# Altium schematic sheet CutMonitor_PressureSensor.SchDoc
size 594 x 420 mm; DocumentNumber: ФНКЦ.452312.001 Э3; SheetNumber: 2; Format: A2
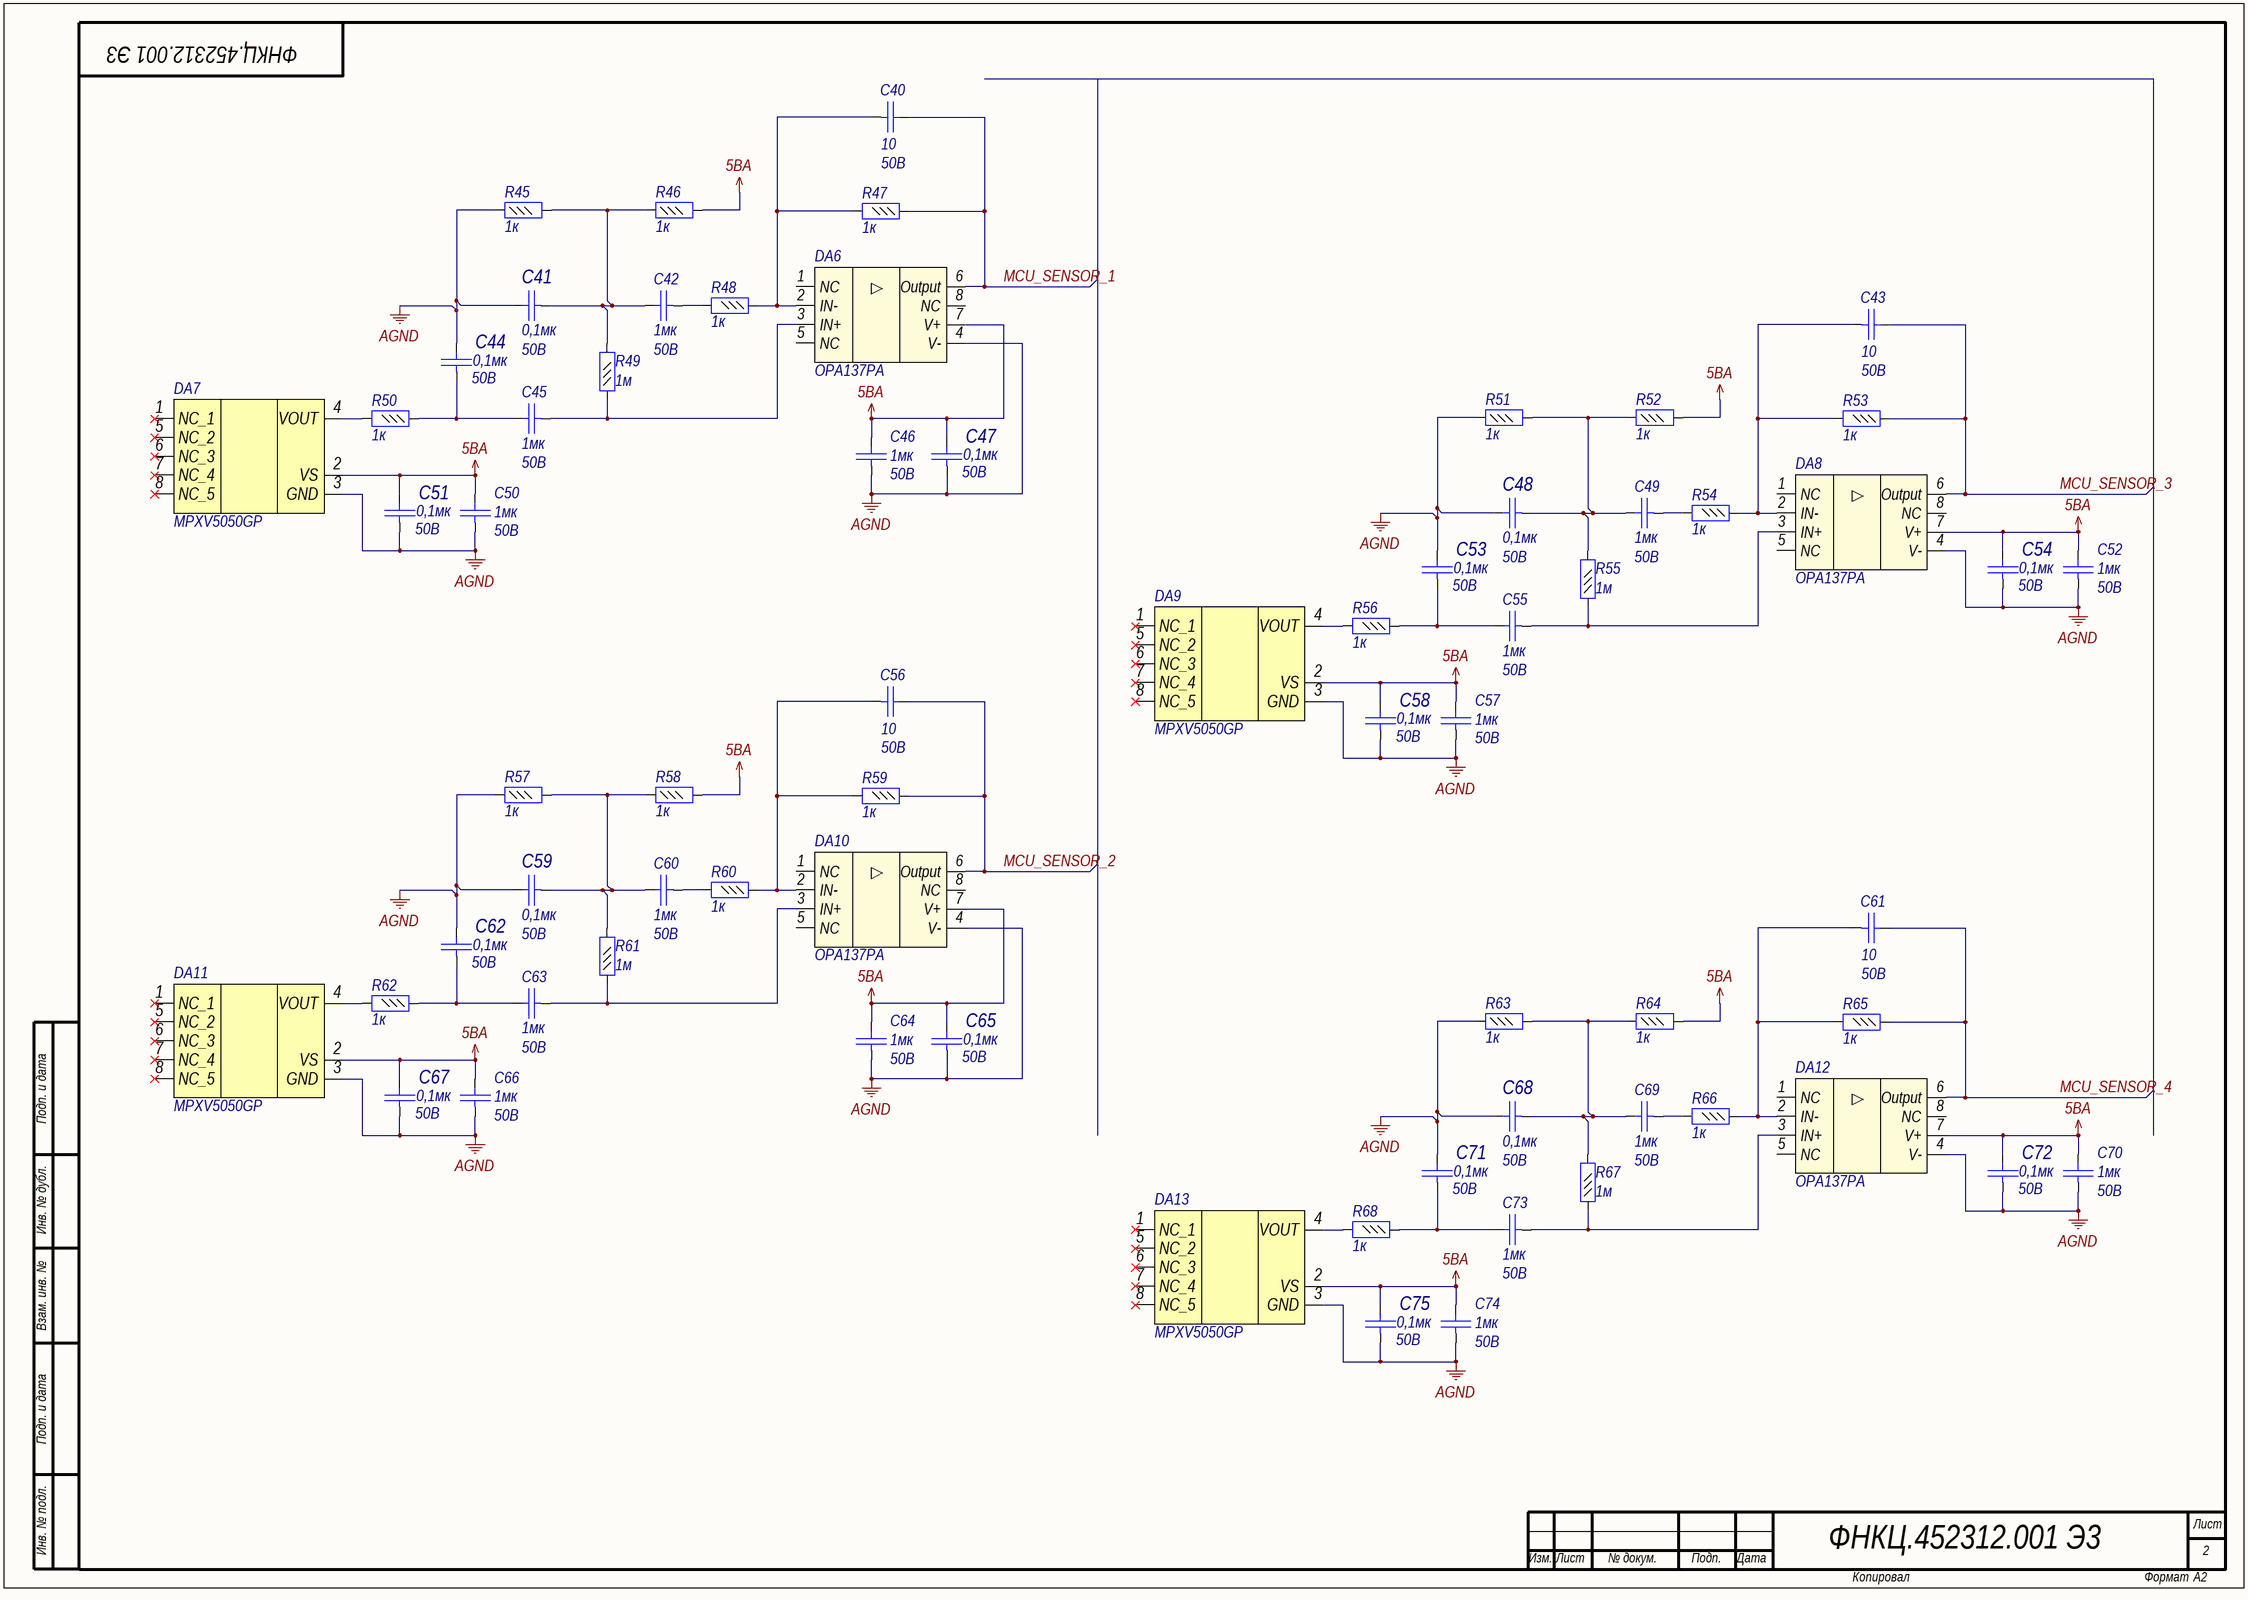
[diagram p0: CutMonitor_PressureSensor.SchDoc]

## Parts
C40  value 10  Voltage: 50B  [C0603]  (hidden comment: Capacitor)
C41  value 0,1мк  Voltage: 50B  [C0603]  (hidden comment: Capacitor)
C42  value 1мк  Voltage: 50B  [C0805]  (hidden comment: Capacitor)
C43  value 10  Voltage: 50B  [C0603]  (hidden comment: Capacitor)
C44  value 0,1мк  Voltage: 50B  [C0603]  (hidden comment: Capacitor)
C45  value 1мк  Voltage: 50B  [C0805]  (hidden comment: Capacitor)
C46  value 1мк  Voltage: 50B  [C0805]  (hidden comment: Capacitor)
C47  value 0,1мк  Voltage: 50B  [C0603]  (hidden comment: Capacitor)
C48  value 0,1мк  Voltage: 50B  [C0603]  (hidden comment: Capacitor)
C49  value 1мк  Voltage: 50B  [C0805]  (hidden comment: Capacitor)
C50  value 1мк  Voltage: 50B  [C0805]  (hidden comment: Capacitor)
C51  value 0,1мк  Voltage: 50B  [C0603]  (hidden comment: Capacitor)
C52  value 1мк  Voltage: 50B  [C0805]  (hidden comment: Capacitor)
C53  value 0,1мк  Voltage: 50B  [C0603]  (hidden comment: Capacitor)
C54  value 0,1мк  Voltage: 50B  [C0603]  (hidden comment: Capacitor)
C55  value 1мк  Voltage: 50B  [C0805]  (hidden comment: Capacitor)
C56  value 10  Voltage: 50B  [C0603]  (hidden comment: Capacitor)
C57  value 1мк  Voltage: 50B  [C0805]  (hidden comment: Capacitor)
C58  value 0,1мк  Voltage: 50B  [C0603]  (hidden comment: Capacitor)
C59  value 0,1мк  Voltage: 50B  [C0603]  (hidden comment: Capacitor)
C60  value 1мк  Voltage: 50B  [C0805]  (hidden comment: Capacitor)
C61  value 10  Voltage: 50B  [C0603]  (hidden comment: Capacitor)
C62  value 0,1мк  Voltage: 50B  [C0603]  (hidden comment: Capacitor)
C63  value 1мк  Voltage: 50B  [C0805]  (hidden comment: Capacitor)
C64  value 1мк  Voltage: 50B  [C0805]  (hidden comment: Capacitor)
C65  value 0,1мк  Voltage: 50B  [C0603]  (hidden comment: Capacitor)
C66  value 1мк  Voltage: 50B  [C0805]  (hidden comment: Capacitor)
C67  value 0,1мк  Voltage: 50B  [C0603]  (hidden comment: Capacitor)
C68  value 0,1мк  Voltage: 50B  [C0603]  (hidden comment: Capacitor)
C69  value 1мк  Voltage: 50B  [C0805]  (hidden comment: Capacitor)
C70  value 1мк  Voltage: 50B  [C0805]  (hidden comment: Capacitor)
C71  value 0,1мк  Voltage: 50B  [C0603]  (hidden comment: Capacitor)
C72  value 0,1мк  Voltage: 50B  [C0603]  (hidden comment: Capacitor)
C73  value 1мк  Voltage: 50B  [C0805]  (hidden comment: Capacitor)
C74  value 1мк  Voltage: 50B  [C0805]  (hidden comment: Capacitor)
C75  value 0,1мк  Voltage: 50B  [C0603]  (hidden comment: Capacitor)
DA6  OPA137PA  [DIP8]
DA7  MPXV5050GP  [SOP8]
DA8  OPA137PA  [DIP8]
DA9  MPXV5050GP  [SOP8]
DA10  OPA137PA  [DIP8]
DA11  MPXV5050GP  [SOP8]
DA12  OPA137PA  [DIP8]
DA13  MPXV5050GP  [SOP8]
R45  value 1к  [R0603]  (hidden comment: Resistor_0,062Вт)
R46  value 1к  [R0603]  (hidden comment: Resistor_0,062Вт)
R47  value 1к  [R0603]  (hidden comment: Resistor_0,062Вт)
R48  value 1к  [R0603]  (hidden comment: Resistor_0,062Вт)
R49  value 1м  [R0603]  (hidden comment: Resistor_0,062Вт)
R50  value 1к  [R0603]  (hidden comment: Resistor_0,062Вт)
R51  value 1к  [R0603]  (hidden comment: Resistor_0,062Вт)
R52  value 1к  [R0603]  (hidden comment: Resistor_0,062Вт)
R53  value 1к  [R0603]  (hidden comment: Resistor_0,062Вт)
R54  value 1к  [R0603]  (hidden comment: Resistor_0,062Вт)
R55  value 1м  [R0603]  (hidden comment: Resistor_0,062Вт)
R56  value 1к  [R0603]  (hidden comment: Resistor_0,062Вт)
R57  value 1к  [R0603]  (hidden comment: Resistor_0,062Вт)
R58  value 1к  [R0603]  (hidden comment: Resistor_0,062Вт)
R59  value 1к  [R0603]  (hidden comment: Resistor_0,062Вт)
R60  value 1к  [R0603]  (hidden comment: Resistor_0,062Вт)
R61  value 1м  [R0603]  (hidden comment: Resistor_0,062Вт)
R62  value 1к  [R0603]  (hidden comment: Resistor_0,062Вт)
R63  value 1к  [R0603]  (hidden comment: Resistor_0,062Вт)
R64  value 1к  [R0603]  (hidden comment: Resistor_0,062Вт)
R65  value 1к  [R0603]  (hidden comment: Resistor_0,062Вт)
R66  value 1к  [R0603]  (hidden comment: Resistor_0,062Вт)
R67  value 1м  [R0603]  (hidden comment: Resistor_0,062Вт)
R68  value 1к  [R0603]  (hidden comment: Resistor_0,062Вт)

## Nets
5BA: C46.2 C47.2 C50.2 C51.2 C52.2 C54.2 C57.2 C58.2 C64.2 C65.2 C66.2 C67.2 C70.2 C72.2 C74.2 C75.2 DA6.7(V+) DA7.2(VS) DA8.7(V+) DA9.2(VS) DA10.7(V+) DA11.2(VS) DA12.7(V+) DA13.2(VS) R46.2 R52.2 R58.2 R64.2
AGND: C41.2 C44.2 C46.1 C47.1 C48.2 C50.1 C51.1 C52.1 C53.2 C54.1 C57.1 C58.1 C59.2 C62.2 C64.1 C65.1 C66.1 C67.1 C68.2 C70.1 C71.2 C72.1 C74.1 C75.1 DA6.4(V-) DA7.3(GND) DA8.4(V-) DA9.3(GND) DA10.4(V-) DA11.3(GND) DA12.4(V-) DA13.3(GND) R45.1 R51.1 R57.1 R63.1
MCU_SENSOR_1: C40.2 DA6.6(Output) R47.1
MCU_SENSOR_2: C56.2 DA10.6(Output) R59.1
MCU_SENSOR_3: C43.2 DA8.6(Output) R53.1
MCU_SENSOR_4: C61.2 DA12.6(Output) R65.1
NetC40_1: C40.1 DA6.2(IN-) R47.2 R48.1
NetC41_1: C41.1 C42.2 R45.2 R46.1 R49.2
NetC42_1: C42.1 R48.2
NetC43_1: C43.1 DA8.2(IN-) R53.2 R54.1
NetC44_1: C44.1 C45.2 R50.1
NetC45_1: C45.1 DA6.3(IN+) R49.1
NetC48_1: C48.1 C49.2 R51.2 R52.1 R55.2
NetC49_1: C49.1 R54.2
NetC53_1: C53.1 C55.2 R56.1
NetC55_1: C55.1 DA8.3(IN+) R55.1
NetC56_1: C56.1 DA10.2(IN-) R59.2 R60.1
NetC59_1: C59.1 C60.2 R57.2 R58.1 R61.2
NetC60_1: C60.1 R60.2
NetC61_1: C61.1 DA12.2(IN-) R65.2 R66.1
NetC62_1: C62.1 C63.2 R62.1
NetC63_1: C63.1 DA10.3(IN+) R61.1
NetC68_1: C68.1 C69.2 R63.2 R64.1 R67.2
NetC69_1: C69.1 R66.2
NetC71_1: C71.1 C73.2 R68.1
NetC73_1: C73.1 DA12.3(IN+) R67.1
NetDA7_4: DA7.4(VOUT) R50.2
NetDA9_4: DA9.4(VOUT) R56.2
NetDA11_4: DA11.4(VOUT) R62.2
NetDA13_4: DA13.4(VOUT) R68.2

Not connected (* = marked no-connect by the designer): DA6 1(NC) 5(NC) 8(NC); DA7 1(NC_1)* 5(NC_2)* 6(NC_3)* 7(NC_4)* 8(NC_5)*; DA8 1(NC) 5(NC) 8(NC); DA9 1(NC_1)* 5(NC_2)* 6(NC_3)* 7(NC_4)* 8(NC_5)*; DA10 1(NC) 5(NC) 8(NC); DA11 1(NC_1)* 5(NC_2)* 6(NC_3)* 7(NC_4)* 8(NC_5)*; DA12 1(NC) 5(NC) 8(NC); DA13 1(NC_1)* 5(NC_2)* 6(NC_3)* 7(NC_4)* 8(NC_5)*

## Notes on the sheet
- Подп. и дата
- Инв. № дубл.
- Взам. инв. №
- Инв. № подл.
- Лист
- Изм.
- № докум.
- Подп.
- Дата
- Копировал
- Формат

## Library data of the parts
C40 C43 C56 C61 = cap71: Конденсатор; Part Name: Ceramic; Manufacture: Murata; Part Number: GRM1885C1H100J; id: cap71; TKE: NP0
C41 C44 C47 C48 C51 C53 C54 C58 C59 C62 C65 C67 C68 C71 C72 C75 = cap131: Конденсатор; Part Name: Ceramic; Manufacture: Murata; Part Number: GRM188R71H104KA93D; id: cap131; TKE: X7R
C42 C45 C46 C49 C50 C52 C55 C57 C60 C63 C64 C66 C69 C70 C73 C74 = cap151: Конденсатор; Part Name: Ceramic; Manufacture: Murata; Part Number: GRM21BR71H105K; id: cap151; TKE: X7R
DA6 DA8 DA10 DA12 = amp11: FET-INPUT OPERATIONAL AMPLIFIERS; Part Name: FET-INPUT Amplifier; Manufacture: Texas Instruments; id: amp11; Rail-to-rail: yes; Supply Voltage: 4,5-36B; Bandwidth: 1МГц; Input Bias Current: 100pA; CMRR: 76-84dB; PSRR: 80,92dB; Offset voltage: 2,5mB; Channels: 1; Part Number: OPA137PA
DA7 DA9 DA11 DA13 = MPXV5050GP: Integrated Silicon Pressure Sensor; Manufacture: Freescale Semiconductor; id: sensor4; Interface: ANALOG; Part Number: MPXV5050GP; Part Name: Integrated Silicon Pressure Sensor; Type sensor: Pressure
R45-R48 R50-R54 R56-R60 R62-R66 R68 = res459: Резистор; Manufacture: Yageo; Part Number: RC0603FR-071KL; id: res459; Accuracy: 0,01; Part Name: Resistor; Power: 0,062Вт
R49 R55 R61 R67 = res531: Резистор; Manufacture: Yageo; Part Number: RC0603FR-071ML; id: res531; Accuracy: 0,01; Part Name: Resistor; Power: 0,062Вт